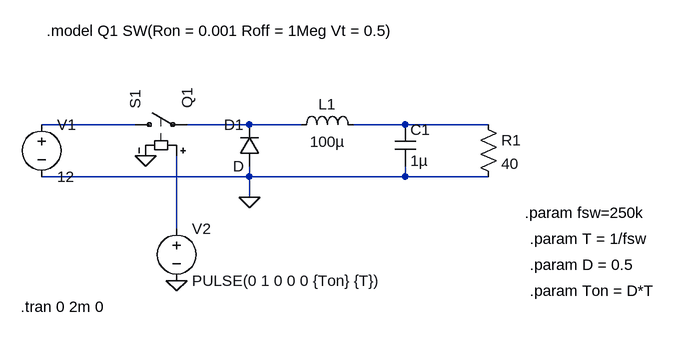
[diagram p0: schematic Buck-Converter-LTspice.asc]
Buck-Converter-LTspice.asc, the LTspice schematic file:
Version 4.1
SHEET 1 936 680
WIRE 64 144 -80 144
WIRE 240 144 144 144
WIRE 320 144 240 144
WIRE 480 144 400 144
WIRE 608 144 480 144
WIRE 240 224 240 208
WIRE 240 224 -80 224
WIRE 480 224 480 208
WIRE 480 224 240 224
WIRE 608 224 480 224
WIRE 240 256 240 224
WIRE 128 304 128 192
FLAG 240 256 0
FLAG 128 384 0
FLAG 80 192 0
SYMBOL sw 48 144 R270
SYMATTR InstName S1
SYMATTR Value Q1
SYMBOL voltage -80 128 R0
WINDOW 123 0 0 Left 0
WINDOW 39 0 0 Left 0
SYMATTR InstName V1
SYMATTR Value 12
SYMBOL voltage 128 288 R0
WINDOW 123 0 0 Left 0
WINDOW 39 0 0 Left 0
SYMATTR InstName V2
SYMATTR Value PULSE(0 1 0 0 0 {Ton} {T})
SYMBOL diode 256 208 R180
WINDOW 0 24 64 Left 2
WINDOW 3 24 0 Left 2
SYMATTR InstName D1
SYMBOL ind 304 160 R270
WINDOW 0 32 56 VTop 2
WINDOW 3 5 56 VBottom 2
SYMATTR InstName L1
SYMATTR Value 100µ
SYMATTR SpiceLine Rser=1m
SYMBOL cap 464 144 R0
SYMATTR InstName C1
SYMATTR Value 1µ
SYMBOL res 592 128 R0
SYMATTR InstName R1
SYMATTR Value 40
TEXT -72 0 Left 2 !.model Q1 SW(Ron = 0.001 Roff = 1Meg Vt = 0.5)
TEXT 664 280 Left 2 !.param fsw=250k
TEXT 672 320 Left 2 !.param T = 1/fsw
TEXT 672 360 Left 2 !.param D = 0.5
TEXT 672 400 Left 2 !.param Ton = D*T
TEXT -112 424 Left 2 !.tran 0 2m 0

The netlist it stands for:
* Buck-Converter-LTspice.asc
S1 N001 N002 N004 0 Q1
V1 N001 0 12
V2 N004 0 PULSE(0 1 0 0 0 {Ton} {T})
D1 0 N002 D
L1 N002 N003 100µ Rser=1m
C1 N003 0 1µ
R1 N003 0 40
.model D D
.lib standard.dio
.model Q1 SW(Ron = 0.001 Roff = 1Meg Vt = 0.5)
.param fsw=250k
.param T = 1/fsw
.param D = 0.5
.param Ton = D*T
.tran 0 2m 0
.backanno
.end